# Altium schematic sheet 1_USB.SchDoc
size A4; SheetNumber: 2; SheetTotal: 6
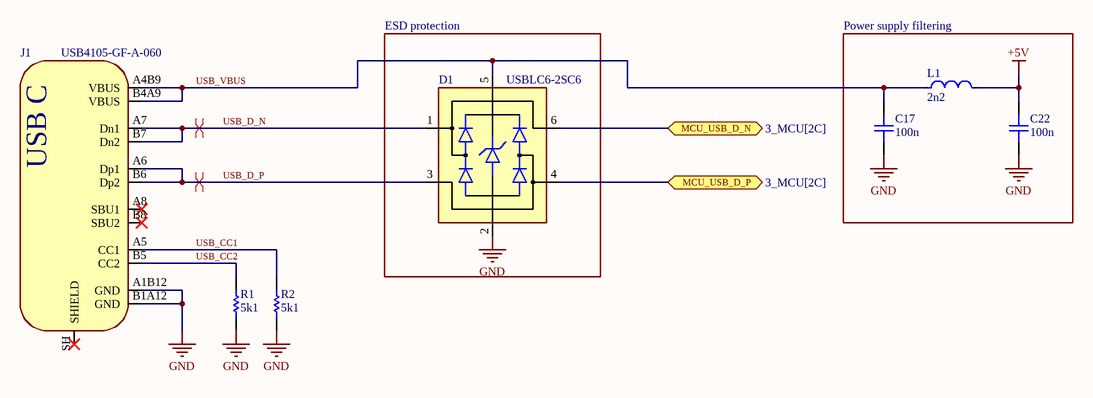
[diagram p0: 1_USB.SchDoc]

## Parts
C17  100n  [CAP_0402]
C22  100n  [CAP_0402]
D1  USBLC6-2SC6  [SOT-23-6]
J1  USB4105-GF-A-060  [USB4105-GF-A-060]
L1  2n2  [FP-LQW15AN_80-MFG]
R1  5k1  [RESC1005X40X25ML10T10]
R2  5k1  [RESC1005X40X25ML10T10]

## Blocks framed on the sheet
ESD protection: D1
Power supply filtering: C17 C22 L1

## Ports
MCU_USB_D_N (bidir, see 3_MCU[2C]), MCU_USB_D_P (bidir, see 3_MCU[2C])

## Nets
+5V: C22.2 L1.2
GND: C17.1 C22.1 D1.2(GND) J1.A1B12(GND) J1.B1A12(GND) R1.2 R2.2
MCU_USB_D_N: D1.6(IO1) ; port MCU_USB_D_N
MCU_USB_D_P: D1.4(IO2) ; port MCU_USB_D_P
USB_CC1: J1.A5(CC1) R2.1
USB_CC2: J1.B5(CC2) R1.1
USB_D_N: D1.1(IO1) J1.A7(Dn1) J1.B7(Dn2)
USB_D_P: D1.3(IO2) J1.A6(Dp1) J1.B6(Dp2)
USB_VBUS: C17.2 D1.5(VBUS) J1.A4B9(VBUS) J1.B4A9(VBUS) L1.1

Not connected (* = marked no-connect by the designer): J1 A8(SBU1)* B8(SBU2)* SH(SHIELD)*

## Layout directives
differential pair: USB_D_N, USB_D_P

## Notes on the sheet
- (in symbol USB4105-GF-A-060) USB C

## Library data of the parts
C17 C22 = CAP_0402_16V: Capacitor SMD 0402 16V; Supplier 1: Mouser; Supplier Part Number 1: 187-CL05A104KP5NNND
D1 = USBLC6-2SC6: Low-Capacitance ESD Protection USB; Manufacturer: STMicroelectronics; Manufacturer Part Number: USBLC6-2SC6; Distributor Link: https://www.mouser.de/ProductDetail/STMicroelectronics/USBLC6-2SC6?qs=po45yt2pPpu%2FhNIlwQdTlg%3D%3D; Supplier 1: Mouser; Supplier Part Number 1: 511-USBLC6-2SC6
J1 = USB4105-GF-A-060: USB Connector Type C SMT 12 Pin; Manufacturer: GCT; Manufacturer Part Number: USB4105-GF-A-060
L1 = CMP-06042-014713-1: Wire Wound RF Inductor 2.2nH ±2% 2530mA 0.022Ω 0402 (1005)
R1 R2 = CMP-2002-03675-1: Part Number: RK73B1ETTP512J; Manufacturer: KOA Speer